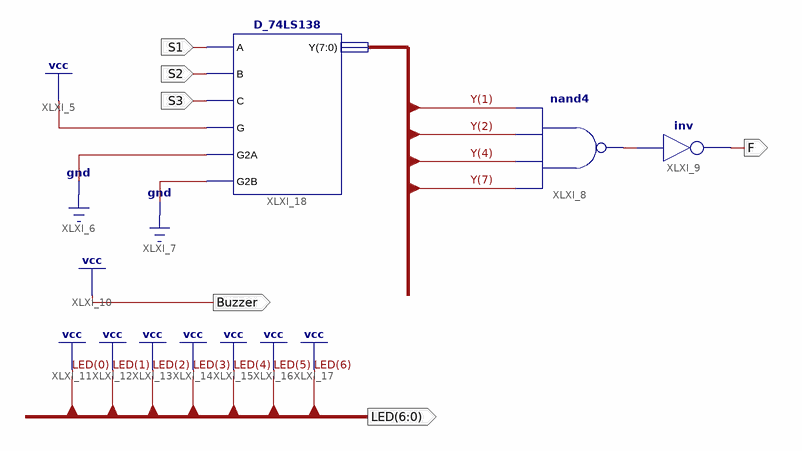
[diagram p0: schematic sheet 1]
// Xilinx ISE schematic Lamp.sch (kintex7) as structural Verilog: 3 symbols, 6 ports
module Lamp (
  input  S1,
  input  S2,
  input  S3,
  output F,
  output Buzzer,
  output [6:0] LED
);

  wire XLXN_8;
  wire [7:0] Y;

  nand XLXI_8 (XLXN_8, Y[7], Y[4], Y[2], Y[1]);
  not XLXI_9 (F, XLXN_8);
  D_74LS138 XLXI_18 (.A(S1), .B(S2), .C(S3), .G(1'b1), .G2A(1'b0), .G2B(1'b0), .Y(Y));

  assign Buzzer = 1'b1;
  assign LED = {7{1'b1}};
endmodule
